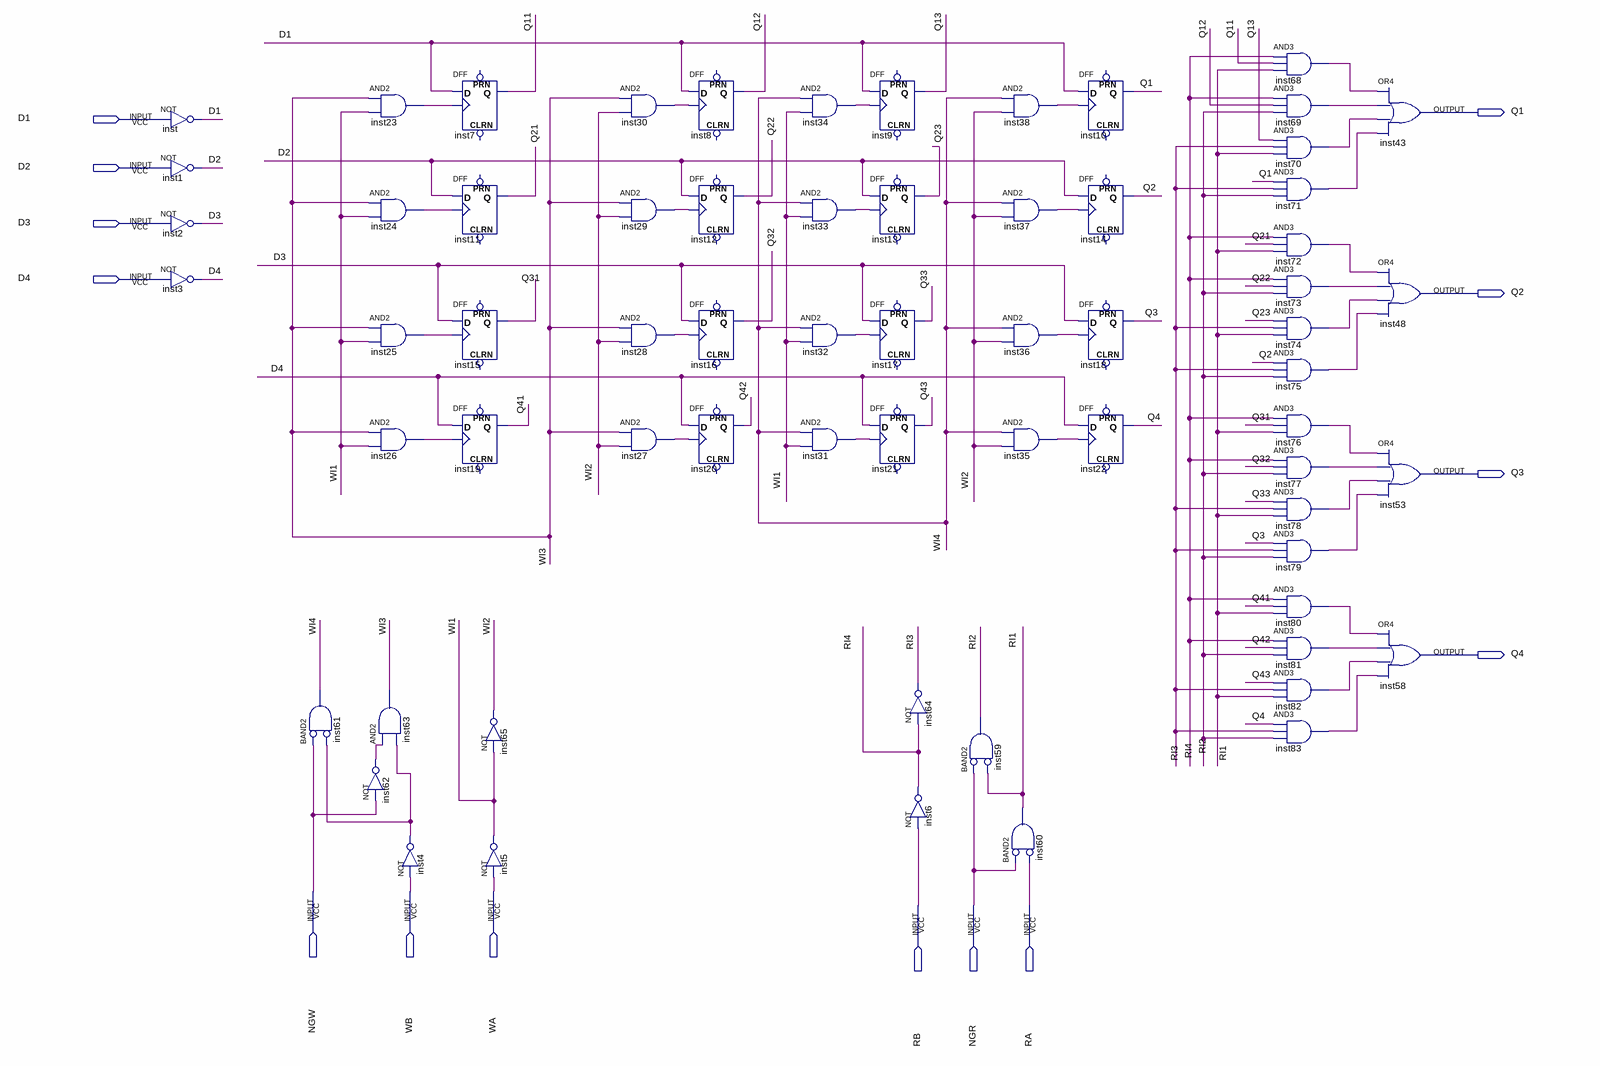
[diagram p0: schematic sheet]
// Quartus schematic SN74170N.bdf as structural Verilog: 66 symbols, 14 pins
module SN74170N (
  input  D1,
  input  D2,
  input  D3,
  input  D4,
  input  NGW,
  input  WB,
  input  WA,
  input  RB,
  input  NGR,
  input  RA,
  output Q1,
  output Q2,
  output Q3,
  output Q4
);

  wire inst4_out, inst23_out, inst24_out, inst25_out, inst26_out, inst27_out, inst28_out, inst29_out,
       inst30_out, inst31_out, inst32_out, inst33_out, inst34_out, inst35_out, inst36_out, inst37_out,
       inst38_out, inst62_out, inst68_out, inst69_out, inst70_out, inst71_out, inst72_out, inst73_out,
       inst74_out, inst75_out, inst76_out, inst77_out, inst78_out, inst79_out, inst80_out, inst81_out,
       inst82_out, inst83_out, Q11, Q12, Q13, Q21, Q22, Q23, Q31, Q32, Q33, Q41, Q42, Q43, RI1, RI2, RI3,
       RI4, WI1, WI2, WI3, WI4;

  not inst (D1, D1);
  not inst1 (D2, D2);
  not inst2 (D3, D3);
  not inst3 (D4, D4);
  and inst61 (WI4, ~NGW, ~inst4_out);  // BAND2
  and inst23 (inst23_out, WI3, WI1);
  and inst24 (inst24_out, WI3, WI1);
  and inst25 (inst25_out, WI3, WI1);
  and inst26 (inst26_out, WI3, WI1);
  and inst63 (WI3, inst62_out, inst4_out);
  not inst62 (inst62_out, NGW);
  not inst4 (inst4_out, WB);
  DFF inst7 (.CLK(inst23_out), .D(D1), .Q(Q11));  // open: CLRN, PRN
  DFF inst11 (.CLK(inst24_out), .D(D2), .Q(Q21));  // open: CLRN, PRN
  DFF inst15 (.CLK(inst25_out), .D(D3), .Q(Q31));  // open: CLRN, PRN
  DFF inst19 (.CLK(inst26_out), .D(D4), .Q(Q41));  // open: CLRN, PRN
  not inst65 (WI2, WI1);
  not inst5 (WI1, WA);
  and inst30 (inst30_out, WI3, WI2);
  and inst29 (inst29_out, WI3, WI2);
  and inst28 (inst28_out, WI3, WI2);
  and inst27 (inst27_out, WI3, WI2);
  DFF inst8 (.CLK(inst30_out), .D(D1), .Q(Q12));  // open: CLRN, PRN
  DFF inst12 (.CLK(inst29_out), .D(D2), .Q(Q22));  // open: CLRN, PRN
  DFF inst16 (.CLK(inst28_out), .D(D3), .Q(Q32));  // open: CLRN, PRN
  DFF inst20 (.CLK(inst27_out), .D(D4), .Q(Q42));  // open: CLRN, PRN
  and inst34 (inst34_out, WI4, WI1);
  and inst33 (inst33_out, WI4, WI1);
  and inst32 (inst32_out, WI4, WI1);
  and inst31 (inst31_out, WI4, WI1);
  DFF inst9 (.CLK(inst34_out), .D(D1), .Q(Q13));  // open: CLRN, PRN
  DFF inst13 (.CLK(inst33_out), .D(D2), .Q(Q23));  // open: CLRN, PRN
  DFF inst17 (.CLK(inst32_out), .D(D3), .Q(Q33));  // open: CLRN, PRN
  DFF inst21 (.CLK(inst31_out), .D(D4), .Q(Q43));  // open: CLRN, PRN
  not inst64 (RI3, RI4);
  not inst6 (RI4, RB);
  and inst59 (RI2, ~NGR, ~RI1);  // BAND2
  and inst38 (inst38_out, WI4, WI2);
  and inst37 (inst37_out, WI4, WI2);
  and inst36 (inst36_out, WI4, WI2);
  and inst35 (inst35_out, WI4, WI2);
  and inst60 (RI1, ~NGR, ~RA);  // BAND2
  DFF inst10 (.CLK(inst38_out), .D(D1), .Q(Q1));  // open: CLRN, PRN
  DFF inst14 (.CLK(inst37_out), .D(D2), .Q(Q2));  // open: CLRN, PRN
  DFF inst18 (.CLK(inst36_out), .D(D3), .Q(Q3));  // open: CLRN, PRN
  DFF inst22 (.CLK(inst35_out), .D(D4), .Q(Q4));  // open: CLRN, PRN
  and inst68 (inst68_out, RI4, Q11, RI1);
  and inst69 (inst69_out, RI4, Q12, RI2);
  and inst70 (inst70_out, Q13, RI3, RI1);
  and inst71 (inst71_out, Q1, RI3, RI2);
  and inst72 (inst72_out, RI4, Q21, RI1);
  and inst73 (inst73_out, RI4, Q22, RI2);
  and inst74 (inst74_out, Q23, RI3, RI1);
  and inst75 (inst75_out, Q2, RI3, RI2);
  and inst76 (inst76_out, RI4, Q31, RI1);
  and inst77 (inst77_out, RI4, Q32, RI2);
  and inst78 (inst78_out, Q33, RI3, RI1);
  and inst79 (inst79_out, Q3, RI3, RI2);
  and inst80 (inst80_out, RI4, Q41, RI1);
  and inst81 (inst81_out, RI4, Q42, RI2);
  and inst82 (inst82_out, Q43, RI3, RI1);
  and inst83 (inst83_out, Q4, RI3, RI2);
  or inst43 (Q1, inst68_out, inst69_out, inst70_out, inst71_out);
  or inst48 (Q2, inst72_out, inst73_out, inst74_out, inst75_out);
  or inst53 (Q3, inst76_out, inst77_out, inst78_out, inst79_out);
  or inst58 (Q4, inst80_out, inst81_out, inst82_out, inst83_out);
endmodule
